# Altium schematic sheet motordriver-v4.0_top-level.SchDoc
size A4; SheetNumber: 1; SheetTotal: 3
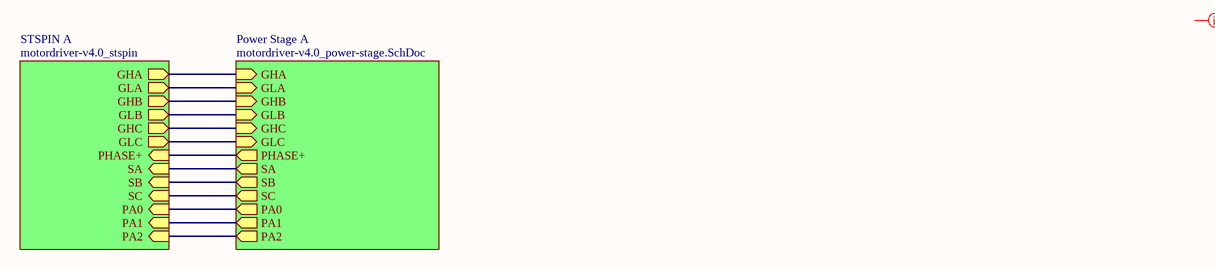
[diagram p0: motordriver-v4.0_top-level.SchDoc]

## Sub-sheets
Power Stage A = motordriver-v4.0_power-stage.SchDoc: GHA (in), GLA (in), GHB (in), GLB (in), GHC (in), GLC (in), PHASE+ (out), SA (out), SB (out), SC (out), PA0 (out), PA1 (out), PA2 (out)
STSPIN A = motordriver-v4.0_stspin: GHA (out), GLA (out), GHB (out), GLB (out), GHC (out), GLC (out), PHASE+ (in), SA (in), SB (in), SC (in), PA0 (in), PA1 (in), PA2 (in)

## Nets
(unnamed): sheet Power Stage A/GHA, sheet STSPIN A/GHA
(unnamed): sheet Power Stage A/GLA, sheet STSPIN A/GLA
(unnamed): sheet Power Stage A/GHB, sheet STSPIN A/GHB
(unnamed): sheet Power Stage A/GLB, sheet STSPIN A/GLB
(unnamed): sheet Power Stage A/GHC, sheet STSPIN A/GHC
(unnamed): sheet Power Stage A/GLC, sheet STSPIN A/GLC
(unnamed): sheet Power Stage A/PHASE+, sheet STSPIN A/PHASE+
(unnamed): sheet Power Stage A/SA, sheet STSPIN A/SA
(unnamed): sheet Power Stage A/SB, sheet STSPIN A/SB
(unnamed): sheet Power Stage A/SC, sheet STSPIN A/SC
(unnamed): sheet Power Stage A/PA0, sheet STSPIN A/PA0
(unnamed): sheet Power Stage A/PA1, sheet STSPIN A/PA1
(unnamed): sheet Power Stage A/PA2, sheet STSPIN A/PA2